# EAGLE design MCU board ATmega328p v2.4 (AW) (EAGLE 9.2.0)
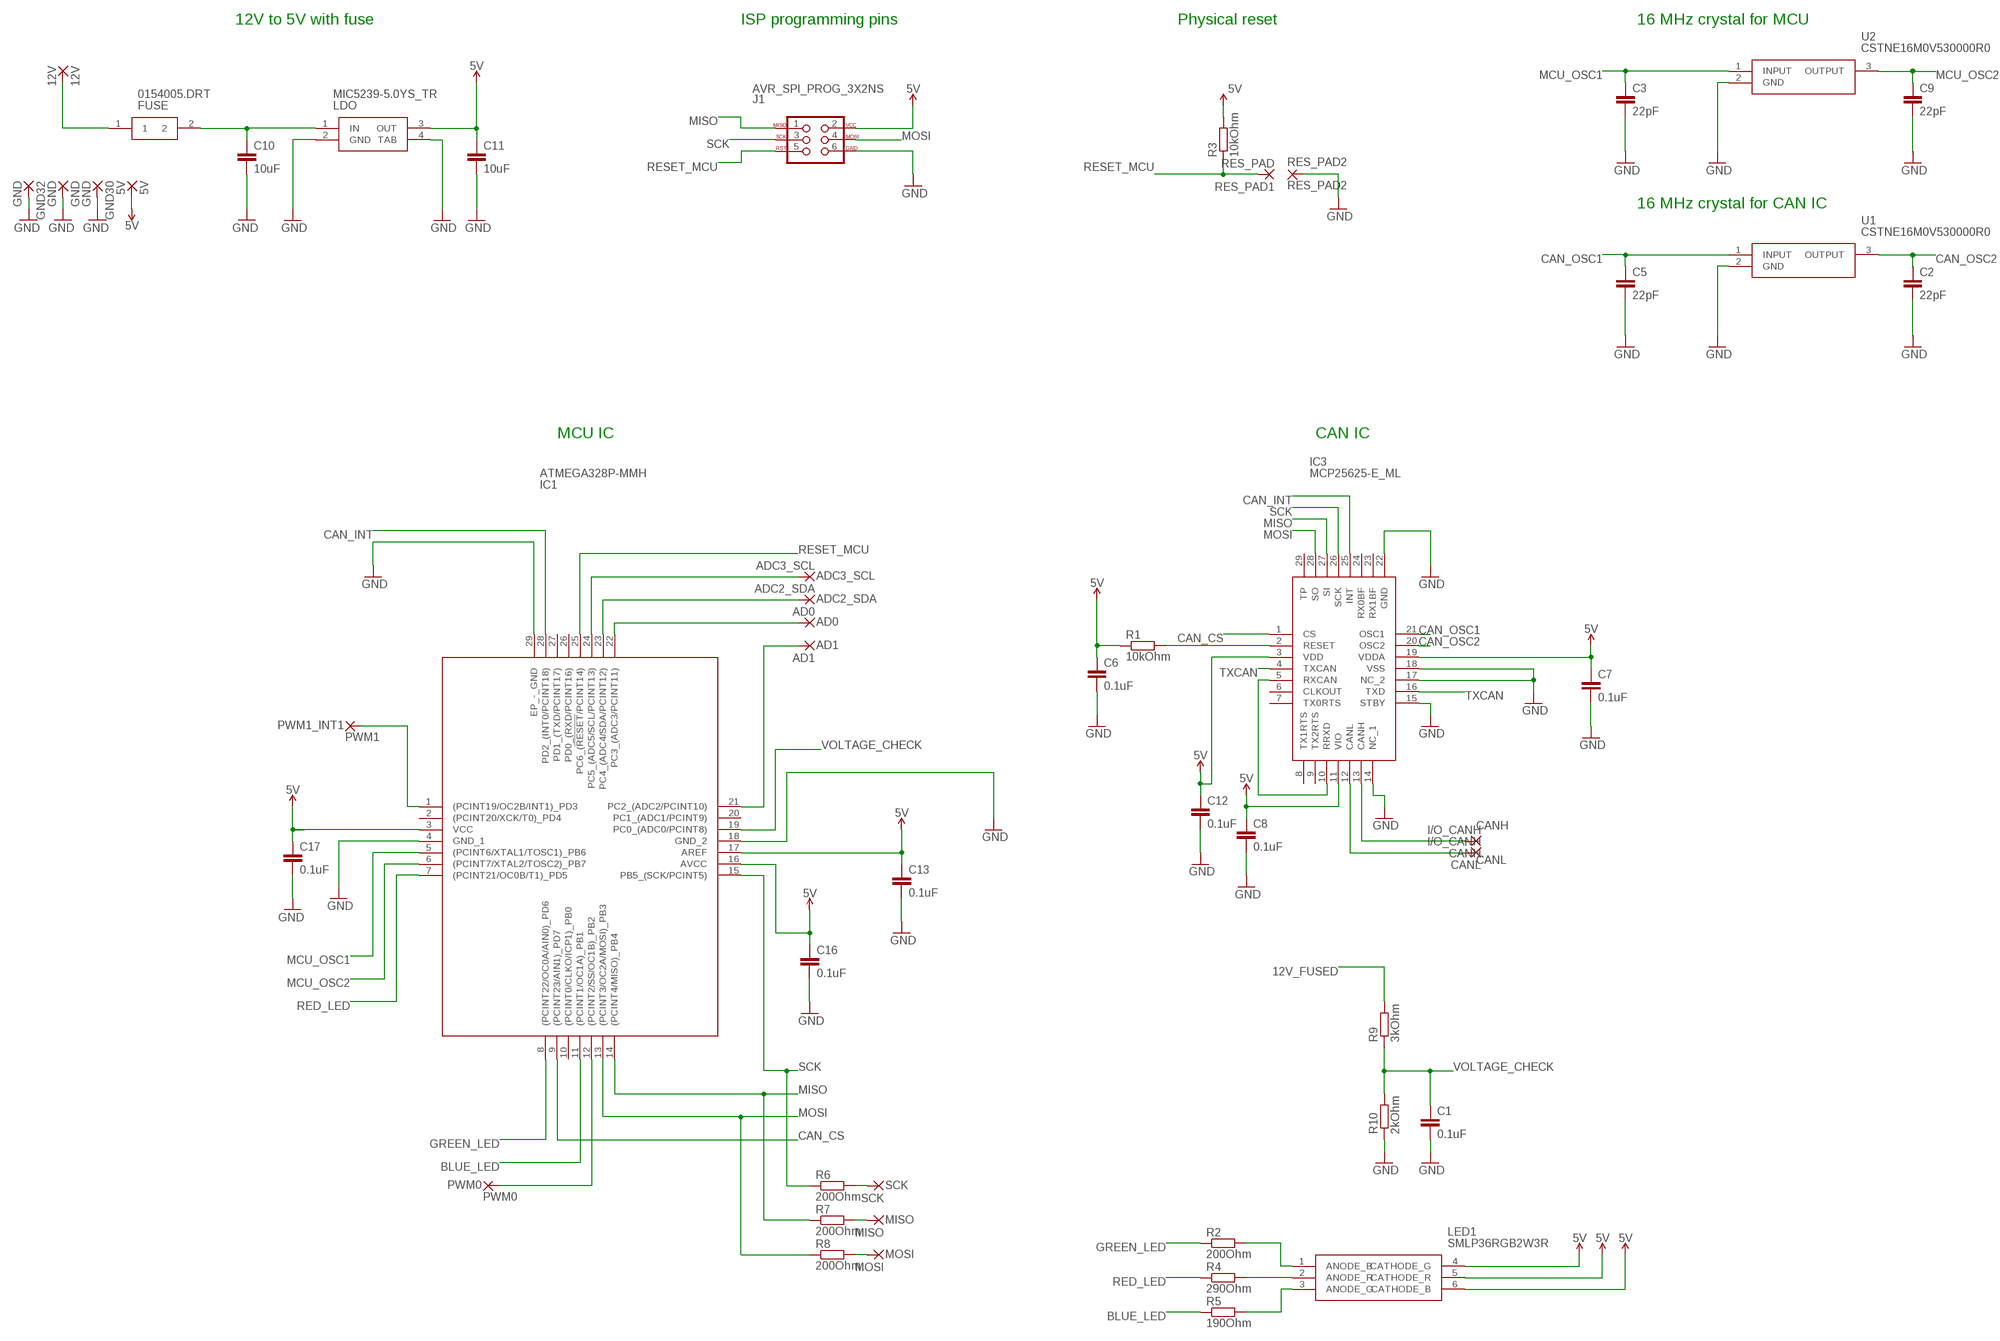
[diagram p0: schematic, sheet 1]

## Parts
5V  5V  2,15/1,0  [2,15/1,0]
12V  12V  2,15/1,0  [2,15/1,0]
AD0  AD0  2,15/1,0  [2,15/1,0]
AD1  AD1  2,15/1,0  [2,15/1,0]
ADC2_SDA  ADC2_SDA  2,15/1,0  [2,15/1,0]
ADC3_SCL  ADC3_SCL  2,15/1,0  [2,15/1,0]
C1  0.1uF  CC0603  [C0603]
C2  22pF  CC0603  [C0603]
C3  22pF  CC0603  [C0603]
C5  22pF  CC0603  [C0603]
C6  0.1uF  CC0603  [C0603]
C7  0.1uF  CC0603  [C0603]
C8  0.1uF  CC0603  [C0603]
C9  22pF  CC0603  [C0603]
C10  10uF  CC0603  [C0603]
C11  10uF  CC0603  [C0603]
C12  0.1uF  CC0603  [C0603]
C13  0.1uF  CC0603  [C0603]
C16  0.1uF  CC0603  [C0603]
C17  0.1uF  CC0603  [C0603]
CANH  I/O_CANH  2,15/1,0  [2,15/1,0]
CANL  I/O_CANH  2,15/1,0  [2,15/1,0]
FUSE  0154005.DRT  [0154001.DRT]
GND  GND  2,15/1,0  [2,15/1,0]
GND30  GND  2,15/1,0  [2,15/1,0]
GND32  GND  2,15/1,0  [2,15/1,0]
IC1  ATMEGA328P-MMH  [QFN45P400X400X100-29N]
IC3  MCP25625-E_ML  [QFN65P600X600X100-29N]
J1  AVR_SPI_PROG_3X2NS  [2X3-NS]
LDO  MIC5239-5.0YS_TR  [SOT230P700X170-4N]
LED1  SMLP36RGB2W3R  [ROHM-1510-(0604)]
MISO  MISO  2,15/1,0  [2,15/1,0]
MOSI  MOSI  2,15/1,0  [2,15/1,0]
PWM0  PWM0  2,15/1,0  [2,15/1,0]
PWM1_INT1  PWM1  2,15/1,0  [2,15/1,0]
R1  10kOhm  RR0603  [R0603]
R2  200Ohm  RR0603  [R0603]
R3  10kOhm  RR0603  [R0603]
R4  290Ohm  RR0603  [R0603]
R5  190Ohm  RR0603  [R0603]
R6  200Ohm  RR0603  [R0603]
R7  200Ohm  RR0603  [R0603]
R8  200Ohm  RR0603  [R0603]
R9  3kOhm  RR0603  [R0603]
R10  2kOhm  RR0603  [R0603]
RES_PAD1  RES_PAD  SMD2  [SMD1,27-2,54]
RES_PAD2  RES_PAD2  SMD2  [SMD1,27-2,54]
SCK  SCK  2,15/1,0  [2,15/1,0]
U1  CSTNE16M0V530000R0  [CSTNE16M0V530000R0]
U2  CSTNE16M0V530000R0  [CSTNE16M0V530000R0]

## Nets
5V: 5V.1(P) C6.1 C7.1 C8.1 C11.1 C12.1 C13.1 C16.1 C17.1 IC1.3(VCC) IC1.16(AVCC) IC1.17(AREF) IC3.3(VDD) IC3.11(VIO) IC3.19(VDDA) J1.2 LDO.3(OUT) LED1.4(CATHODE_G) LED1.5(CATHODE_R) LED1.6(CATHODE_B) R1.1 R3.2
12V_FUSED: C10.1 FUSE.2 LDO.1(IN) R9.2
12V_UNFUSED: 12V.1(P) FUSE.1
BLUE_LED: IC1.11((PCINT1/OC1A)_PB1) R5.1
CAN_CS: IC1.9((PCINT23/AIN1)_PD7) IC3.1(CS)
CAN_INT: IC1.28(PD2_(INT0/PCINT18)) IC3.25(INT)
CAN_OSC1: C5.1 IC3.21(OSC1) U1.1(INPUT)
CAN_OSC2: C2.1 IC3.20(OSC2) U1.3(OUTPUT)
CANH: CANH.1(P) IC3.13(CANH)
CANL: CANL.1(P) IC3.12(CANL)
GND: C1.2 C2.2 C3.2 C5.2 C6.2 C7.2 C8.2 C9.2 C10.2 C11.2 C12.2 C13.2 C16.2 C17.2 GND30.1(P) GND32.1(P) GND.1(P) IC1.4(GND_1) IC1.18(GND_2) IC1.29(EP_-_GND) IC3.14(NC_1) IC3.15(STBY) IC3.17(NC_2) IC3.18(VSS) IC3.22(GND) J1.6 LDO.2(GND) LDO.4(TAB) R10.1 RES_PAD2.1(P) U1.2(GND) U2.2(GND)
GREEN_LED: IC1.8((PCINT22/OC0A/AIN0)_PD6) R2.1
I/O_D2_INT: IC1.1((PCINT19/OC2B/INT1)_PD3) PWM1_INT1.1(P)
MCU_OSC1: C3.1 IC1.5((PCINT6/XTAL1/TOSC1)_PB6) U2.1(INPUT)
MCU_OSC2: C9.1 IC1.6((PCINT7/XTAL2/TOSC2)_PB7) U2.3(OUTPUT)
MISO: IC1.14((PCINT4/MISO)_PB4) IC3.27(SI) J1.1 R7.1
MOSI: IC1.13((PCINT3/OC2A/MOSI)_PB3) IC3.28(SO) J1.4 R8.1
N$1: IC3.2(RESET) R1.2
N$2: IC1.12((PCINT2/SS/OC1B)_PB2) PWM0.1(P)
N$3: AD1.1(P) IC1.21(PC2_(ADC2/PCINT10))
N$4: LED1.1(ANODE_B) R2.2
N$5: AD0.1(P) IC1.22(PC3_(ADC3/PCINT11))
N$6: ADC2_SDA.1(P) IC1.23(PC4_(ADC4/SDA/PCINT12))
N$7: ADC3_SCL.1(P) IC1.24(PC5_(ADC5/SCL/PCINT13))
N$8: LED1.2(ANODE_R) R4.2
N$9: LED1.3(ANODE_G) R5.2
N$10: R6.2 SCK.1(P)
N$11: MISO.1(P) R7.2
N$12: MOSI.1(P) R8.2
RED_LED: IC1.7((PCINT21/OC0B/T1)_PD5) R4.1
RESET_MCU: IC1.25(PC6_(!RESET!/PCINT14)) J1.5 R3.1 RES_PAD1.1(P)
RXCAN: IC3.5(RXCAN) IC3.10(RRXD)
SCK: IC1.15(PB5_(SCK/PCINT5)) IC3.26(SCK) J1.3 R6.1
TXCAN: IC3.4(TXCAN) IC3.16(TXD)
VOLTAGE_CHECK: C1.1 IC1.19(PC0_(ADC0/PCINT8)) R9.1 R10.2
Unconnected: IC1.2((PCINT20/XCK/T0)_PD4) IC1.10((PCINT0/CLKO/ICP1)_PB0) IC1.20(PC1_(ADC1/PCINT9)) IC1.26(PD0_(RXD/PCINT16)) IC1.27(PD1_(TXD/PCINT17)) IC3.6(CLKOUT) IC3.7(TX0RTS) IC3.8(TX1RTS) IC3.9(TX2RTS) IC3.23(RX1BF) IC3.24(RX0BF) IC3.29(TP)

## Notes on the sheet
- 12V to 5V with fuse | ISP programming pins | Physical reset | 16 MHz crystal for MCU
- 16 MHz crystal for CAN IC
- MCU IC | CAN IC

## Library data of the parts
5V 12V AD0 AD1 ADC2_SDA ADC3_SCL CANH CANL GND GND30 GND32 MISO MOSI PWM0 PWM1_INT1 SCK = wirepad:2,15/1,0: THROUGH-HOLE PAD
C1-C3 C5-C13 C16 C17 = eagle-ltspice:C: CAPACITOR, European symbol; SPICEMODEL: NONE; SPICEPREFIX: C
FUSE = 0154005(Fuseholder)DRT:0154005.DRT: Littelfuse 5A T Surface Mount Fuse, 125V ac/dc Source: Datasheet <http://www.littelfuse.com/~/media/electronics/datasheets/fuses/littelfuse_fuse_154_154t_154l_154tl_datasheet.pdf.pdf>; ALLIED_NUMBER: 70184875; ALLIED_PRICE-STOCK: https://www.alliedelec.com/littelfuse-0154005-drt/70184875/; ARROW_PART_NUMBER: 0154005.DRT; ARROW_PRICE-STOCK: https://www.arrow.com/en/products/0154005.drt/littelfuse; DESCRIPTION: Littelfuse 5A T Surface Mount Fuse, 125V ac/dc; HEIGHT: mm; MANUFACTURER_NAME: LITTELFUSE; MANUFACTURER_PART_NUMBER: 0154005.DRT; RS_PART_NUMBER: 2196260P; RS_PRICE-STOCK: http://uk.rs-online.com/web/p/products/2196260P
IC1 = ATMEGA328P-MMH:ATMEGA328P-MMH: Atmel ATMEGA328P-MMH, 8bit AVR Microcontroller, 20MHz, 32 kB Flash, 28-Pin QFN Source: Datasheet <http://uk.rs-online.com/web/p/products/8149138P>; ARROW_PART_NUMBER: ATMEGA328P-MMH; ARROW_PRICE-STOCK: https://www.arrow.com/en/products/atmega328p-mmh/microchip-technology; DESCRIPTION: Atmel ATMEGA328P-MMH, 8bit AVR Microcontroller, 20MHz, 32 kB Flash, 28-Pin QFN; HEIGHT: 1mm; MANUFACTURER_NAME: Microchip; MANUFACTURER_PART_NUMBER: ATMEGA328P-MMH; RS_PART_NUMBER: 1310272P; RS_PRICE-STOCK: http://uk.rs-online.com/web/p/products/1310272P
IC3 = MCP25625-E_ML:MCP25625-E_ML: CAN Controller with Transceiver QFN28 Microchip MCP25625-E/ML, CAN Controller, 28-Pin QFN Source: Datasheet <http://docs-europe.electrocomponents.com/webdocs/137c/0900766b8137cddf.pdf>; ALLIED_NUMBER: 70431541; ALLIED_PRICE-STOCK: http://www.alliedelec.com/microchip-technology-inc-mcp25625-e-ml/70431541/; ARROW_PART_NUMBER: MCP25625-E/ML; ARROW_PRICE-STOCK: https://www.arrow.com/en/products/mcp25625-eml/microchip-technology; DESCRIPTION: CAN Controller with Transceiver QFN28 Microchip MCP25625-E/ML, CAN Controller, 28-Pin QFN; HEIGHT: 1mm; MANUFACTURER_NAME: Microchip; MANUFACTURER_PART_NUMBER: MCP25625-E/ML; RS_PART_NUMBER: 1654104; RS_PRICE-STOCK: http://uk.rs-online.com/web/p/products/1654104
J1 = SparkFun-Connectors:AVR_SPI_PROG_3X2: AVR ISP 6 Pin This is the reduced ISP connector for AVR programming. Common on Arduino. This footprint will take up less PCB space and can be used with a 10-pin to 6-pin adapter such as SKU: BOB-08508 **Special note about "TEST_POINT" package. The stop mask is on the top side, so if you want your programming test points to be on the bottom of your board, make sure to place this package on the bottom side of the board. This also ensure that the orientation to program from the bottom side will be correct. SparkFun Products: SparkFun ISP Pogo Adapter <https://www.sparkfun.com/products/11591> - NS Tiny AVR Programmer <https://www.sparkfun.com/products/11801> -PTH
LDO = MIC5239-5.0YS_TR:MIC5239-5.0YS_TR: LDO Regulator Pos 5V 0.5A Micrel MIC5239-5.0YS TR, LDO Voltage Regulator, 500mA, 5 V 1%, 2.3 30 Vin, 3 + Tab-Pin SOT-223 Source: Datasheet <http://ww1.microchip.com/downloads/en/DeviceDoc/mic5239.pdf>; ARROW_PART_NUMBER: MIC5239-5.0YS TR; ARROW_PRICE-STOCK: http://uk.rs-online.com/web/p/products/7275535P; DESCRIPTION: LDO Regulator Pos 5V 0.5A Micrel MIC5239-5.0YS TR, LDO Voltage Regulator, 500mA, 5 V 1%, 2.3 30 Vin, 3 + Tab-Pin SOT-223; HEIGHT: 1.7mm; MANUFACTURER_NAME: Micrel; MANUFACTURER_PART_NUMBER: MIC5239-5.0YS TR; RS_PART_NUMBER: 7275535P; RS_PRICE-STOCK: http://uk.rs-online.com/web/p/products/7275535P
LED1 = SMLP36RGB2W3R:SMLP36RGB2W3R: LED,RGB,35/110/35mcd,top-looking,1510 ROHM SMLP36RGB2W3R, SML-P36 Series 3 RGB LED, 475 (Blue) nm, 535 (Green) nm, 629 (Red) nm 6-Pin Milky White Source: Datasheet <http://www.rohm.com/web/global/datasheet/SMLP36RGB2W(R)>; ARROW_PART_NUMBER: SMLP36RGB2W3R; ARROW_PRICE-STOCK: https://www.arrow.com/en/products/smlp36rgb2w3r/rohm-semiconductor; DESCRIPTION: LED,RGB,35/110/35mcd,top-looking,1510 ROHM SMLP36RGB2W3R, SML-P36 Series 3 RGB LED, 475 (Blue) nm, 535 (Green) nm, 629 (Red) nm 6-Pin Milky White; HEIGHT: mm; MANUFACTURER_NAME: ROHM Semiconductor; MANUFACTURER_PART_NUMBER: SMLP36RGB2W3R; RS_PART_NUMBER: 1246884P; RS_PRICE-STOCK: http://uk.rs-online.com/web/p/products/1246884P
R1-R10 = eagle-ltspice:R: RESISTOR, European symbol; SPICEMODEL: NONE; SPICEPREFIX: R
RES_PAD1 RES_PAD2 = wirepad:SMD2: SMD PAD
U1 U2 = CSTNE16M0V530000R0:CSTNE16M0V530000R0: Resonators 16.0000MHz 15pF SMD CHP Resntr Source: Datasheet <https://www.murata.com/en-eu/products/productdata/8801162231838/SPEC-CSTNE16M0V530000R0.pdf?1519875007000>; ARROW_PART_NUMBER: CSTNE16M0V530000R0; ARROW_PRICE-STOCK: https://www.arrow.com/en/products/cstne16m0v530000r0/murata-manufacturing; DESCRIPTION: Resonators 16.0000MHz 15pF SMD CHP Resntr; HEIGHT: 1mm; MANUFACTURER_NAME: Murata Electronics; MANUFACTURER_PART_NUMBER: CSTNE16M0V530000R0

## Board
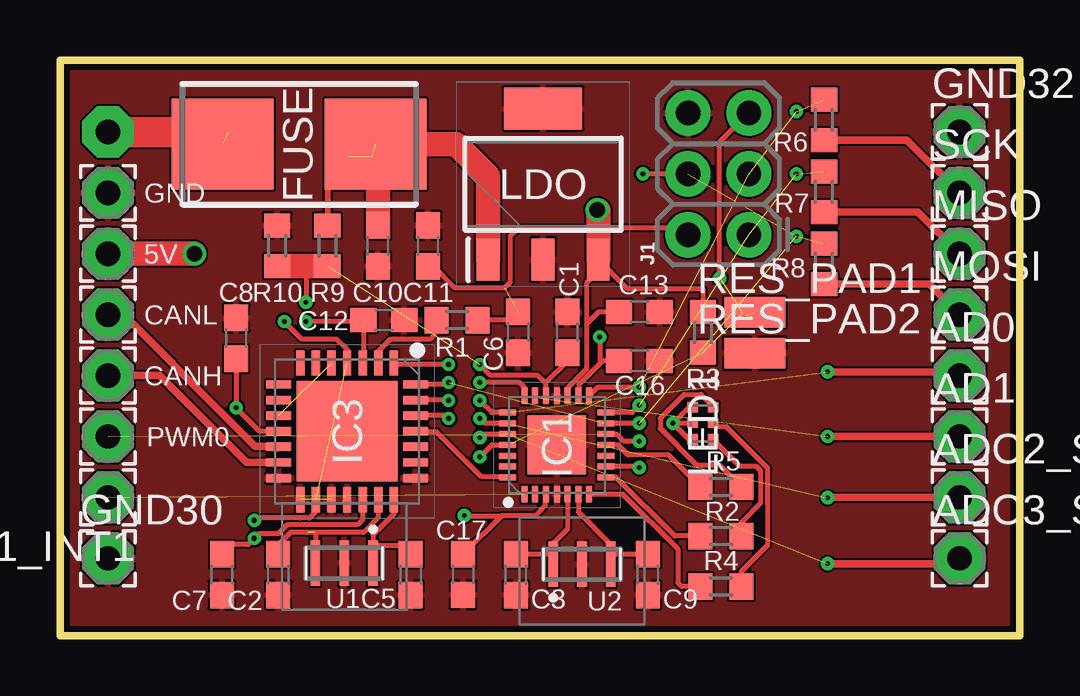
[diagram p1: board, top side]
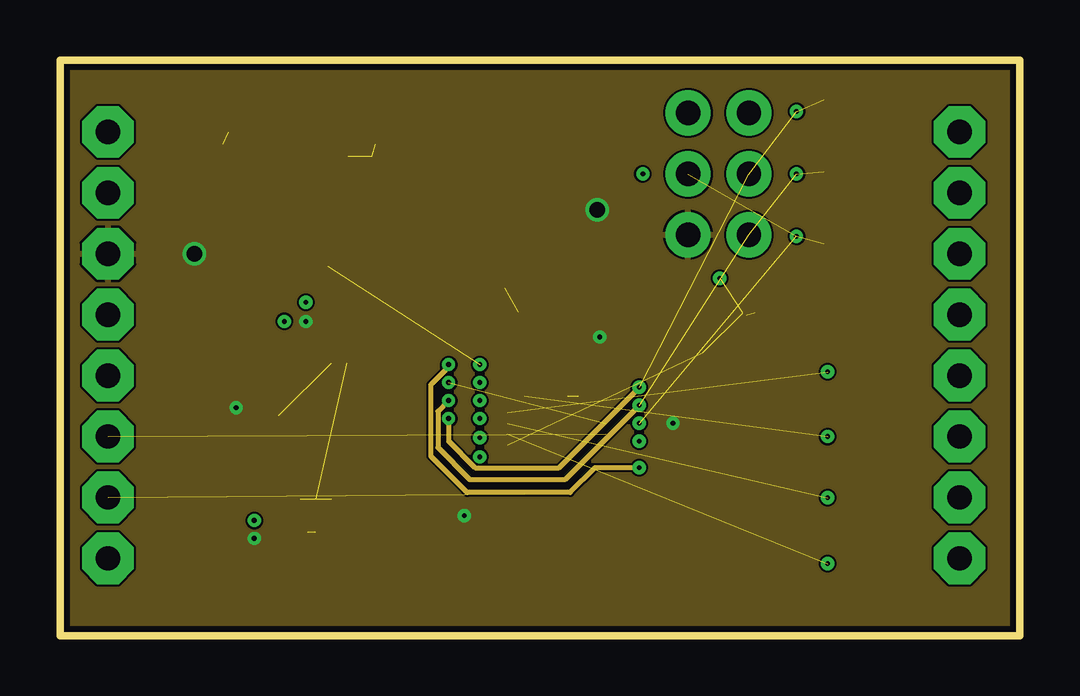
[diagram p2: board, inner layer Route2]
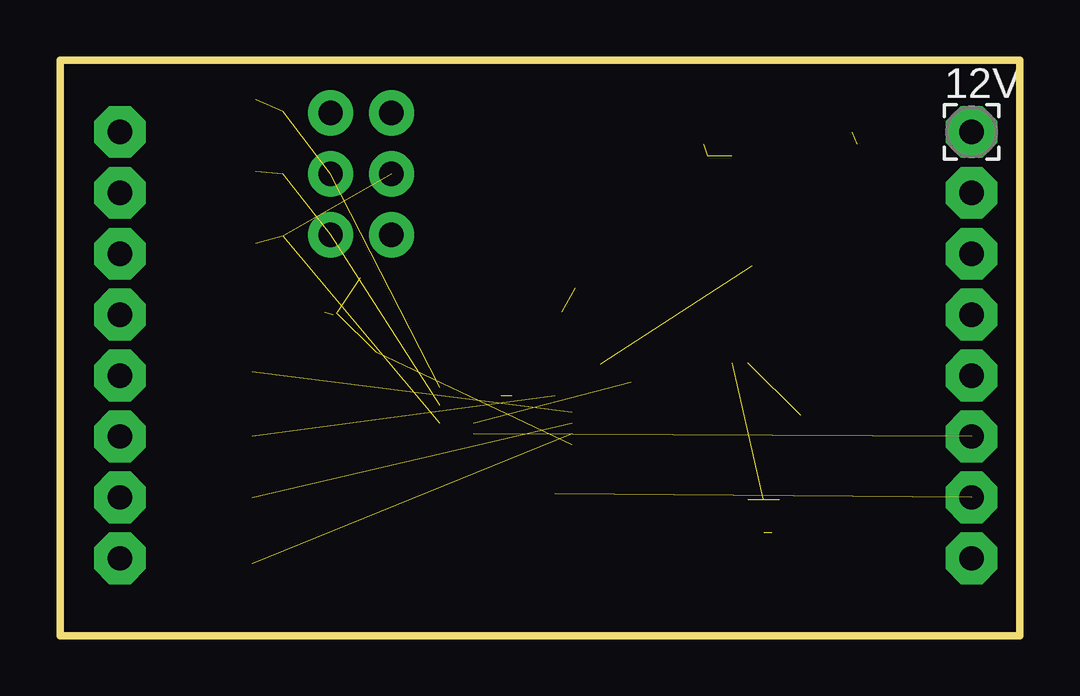
[diagram p3: board, bottom side, seen from below]

Size 40 x 24 mm. Coordinates in mm from the lower left corner, seen from the top.
Outline: 0,0 40,0 40,24 0,24 0,0
Copper layers (1*2*3*4): Top 0.035mm / dielectric 0.432mm / Route2 0.017mm / dielectric 0.432mm / Route3 0.017mm / dielectric 0.432mm / Route4 0.035mm
Design rules "JLC_4L_ACM_CAN *": minimum track width 3.5mil, minimum drill 0.2mm, track to track 3.5mil, track to pad 8mil, pad to pad 6mil, via to via 6mil, smd to smd 6mil, copper to edge 10mil, drill to drill 8mil, minimum pad ring 4mil, minimum via ring 4mil, stop-mask expansion 4mil, vias tented up to drill 25mil, thermal gap 4mil

### Footprints (pad centres in the part's own frame; a part is rotated, then mirrored left to right if it is on the bottom)
2,15/1,0 = drill 1.016 pad 2.159 octagon: 1 0,0
C0603 = smd 1.1 x 1: 1 -0.85,0; 2 0.85,0
0154001.DRT = smd 4.242 x 3.81: 1 -3.188,0; 2 3.188,0
QFN45P400X400X100-29N = smd 0.7 x 0.25: 1 -2.05,1.35; 2 -2.05,0.9; 3 -2.05,0.45; 4 -2.05,0; 5 -2.05,-0.45; 6 -2.05,-0.9; 7 -2.05,-1.35; 15 2.05,-1.35; 16 2.05,-0.9; 17 2.05,-0.45; 18 2.05,0; 19 2.05,0.45; 20 2.05,0.9; 21 2.05,1.35 | smd 0.25 x 0.7: 8 -1.35,-2.05; 9 -0.9,-2.05; 10 -0.45,-2.05; 11 0,-2.05; 12 0.45,-2.05; 13 0.9,-2.05; 14 1.35,-2.05; 22 1.35,2.05; 23 0.9,2.05; 24 0.45,2.05; 25 0,2.05; 26 -0.45,2.05; 27 -0.9,2.05; 28 -1.35,2.05 | smd 2.45 x 2.45: 29 0,0
QFN65P600X600X100-29N = smd 1.05 x 0.35: 1 -2.85,1.95; 2 -2.85,1.3; 3 -2.85,0.65; 4 -2.85,0; 5 -2.85,-0.65; 6 -2.85,-1.3; 7 -2.85,-1.95; 15 2.85,-1.95; 16 2.85,-1.3; 17 2.85,-0.65; 18 2.85,0; 19 2.85,0.65; 20 2.85,1.3; 21 2.85,1.95 | smd 0.35 x 1.05: 8 -1.95,-2.85; 9 -1.3,-2.85; 10 -0.65,-2.85; 11 0,-2.85; 12 0.65,-2.85; 13 1.3,-2.85; 14 1.95,-2.85; 22 1.95,2.85; 23 1.3,2.85; 24 0.65,2.85; 25 0,2.85; 26 -0.65,2.85; 27 -1.3,2.85; 28 -1.95,2.85 | smd 4.2 x 4.2: 29 0,0
2X3-NS = drill 1.016 pad 1.88: 1 -2.54,-1.27; 2 -2.54,1.27; 3 0,-1.27; 4 0,1.27; 5 2.54,-1.27; 6 2.54,1.27
SOT230P700X170-4N = smd 1.75 x 0.95: 1 -3.15,2.3; 2 -3.15,0; 3 -3.15,-2.3 | smd 1.75 x 3.25: 4 3.15,0
ROHM-1510-(0604) = smd 0.45 x 0.45: 1 -0.675,-0.425; 3 0.675,-0.425; 4 0.675,0.425; 6 -0.675,0.425 | smd 0.4 x 0.45: 2 0,-0.425; 5 0,0.425
R0603 = smd 1 x 1.1: 1 -0.85,0; 2 0.85,0
SMD1,27-2,54 = smd 1.27 x 2.54: 1 0,0
CSTNE16M0V530000R0 = smd 0.4 x 1.9: 1 -1.2,0.425; 2 0,0.425; 3 1.2,0.425

### Placement (x,y rotation side)
5V  2,15.92 0 top
12V  2,21 0 bottom
AD0  37.5,10.84 0 top
AD1  37.5,8.3 0 top
ADC2_SDA  37.5,5.76 0 top
ADC3_SCL  37.5,3.22 0 top
C1  21.15,12.65 90 top
C2  9.1,2.54 270 top
C3  19,2.54 270 top
C5  14.61,2.54 270 top
C6  19.1,12.65 270 top
C7  6.75,2.54 270 top
C8  7.35,12.4 90 top
C9  24.5,2.54 270 top
C10  13.25,16.25 270 top
C11  15.35,16.25 90 top
C12  13.5,13.15 0 top
C13  24.15,13.5 0 top
C16  24.15,11.45 0 top
C17  16.8,2.55 270 top
CANH  2,10.84 0 top
CANL  2,13.38 0 top
FUSE  9.97,20.49 0 top
GND  2,18.46 0 top
GND30  2,3.22 0 top
GND32  37.5,21 0 top
IC1  20.71,7.95 90 top
IC3  11.97,8.52 270 top
J1  27.45,19.25 90 top
LDO  20.14,18.82 90 top
LED1  26.8,8.85 90 top
MISO  37.5,15.92 0 top
MOSI  37.5,13.38 0 top
PWM0  2,8.3 0 top
PWM1_INT1  2,5.76 180 top
R1  16.55,13.15 180 top
R2  27.55,4.15 0 top
R3  26.8,12.65 90 top
R4  27.55,2.05 0 top
R5  27.55,6.2 0 top
R6  31.85,21.5 270 top
R7  31.85,18.5 270 top
R8  31.85,15.5 270 top
R9  11.15,16.25 90 top
R10  9.05,16.25 270 top
RES_PAD1  28.96,13.47 270 top
RES_PAD2  28.96,11.78 270 top
SCK  37.5,18.46 0 top
U1  11.85,3.45 180 top
U2  21.76,2.55 0 top

### Tracks (layer width: path | path; a pad name or v marks a point on that pad's centre or on a via)
5V  (via drill 0.2 pad 0.55 layers 1-4, 0.65 pad 0.65 layers 1-4)  (2 unrouted)
  Top 0.2: C11.1 15.56,15.4 16.47,14.49 18.54,14.49 18.77,14.72 18.77,16.64 19.13,17 22.44,17 25.89,17 J1.2 | IC3.11 8.33,8.52 v7.35,9.5 C8.1 | IC3.19 12.62,4.84 12.4,4.62 9.47,4.62 9.1,4.25 8.3,4.25 v8.1,4.05 7.85,3.8 6.97,3.8 C7.1 | R3.2 26.8,14.45 23.66,14.45 LDO.3 | v10.25,13.1 12.6,13.1 C12.1 12.65,11.4 IC3.3 | R1.1 18.75,13.15 C6.1 | IC1.17 21.16,10.33 21.95,11.12 21.95,13 | 22.2,14.95 21.95,14.7 21.95,13 | 21.95,13 22.45,13.5 C13.1 | v22.5,12.45 22.5,11.34 | IC1.16 21.63,10.02 21.63,10.48 22.5,11.34 | 22.5,11.34 22.61,11.45 C16.1 | LED1.5 v25.55,8.85 | LED1.4 26.23,9.53 v25.55,8.85 | LED1.6 26.23,8.18 v25.55,8.85 | C17.1 18.4,5 | IC1.3 20.24,5.88 20.24,5.42 19.81,5 18.4,5 | v16.85,5 18.4,5
  Top 1.016: LDO.3 22.44,17 22.44,17.71 v22.4,17.75 | v5.6,15.92 5V.1
  pour Route2: 0,24 40,24 40,0 0,0
12V_FUSED  (2 unrouted)
  Top 0.254: R9.2 11.15,19.15 12,20
  Top 1.016: LDO.1 17.84,19.16 16.51,20.49 FUSE.2 | C10.1 13.25,19.75 13,20
12V_UNFUSED  (1 unrouted)
  Top 1.27: 7,21 12V.1
BLUE_LED
  Top 0.2: IC1.11 23.25,7.95 23.68,7.53 25.37,7.53 R5.1
CAN_CS  (via drill 0.2 pad 0.55 layers 1-4)
  Top 0.2: 13.92,10.97 IC3.1 13.99,11.3 v16.2,11.3 | v24.15,7 24.1,7.05 IC1.9
  Route2 0.2: v24.15,7 22.31,7 21.27,5.96 16.97,5.96 15.46,7.47 15.46,10.46 16.2,11.2 v16.2,11.3
CAN_INT
  Top 0.2: IC1.28 18.64,6.62 17.58,6.62 15.71,8.5 14.84,8.5 IC3.25
CAN_OSC1
  Top 0.2: IC3.21 13.92,5.07 13.05,4.2 13.05,3.75 | 13.05,3.75 U1.1 | 13.05,3.75 14.25,3.75 C5.1
CAN_OSC2  (1 unrouted)
  Top 0.2: U1.3 10.65,4.3 9.61,4.3 9.1,3.79 C2.1 | IC3.20 13.27,4.92 12.65,4.3 10.32,4.3
CANH
  Top 0.305: 9.09,7.25 IC3.13 7.78,7.22 4.16,10.84 CANH.1
CANL
  Top 0.305: 9.07,7.82 IC3.12 9.1,7.89 8.14,7.89 6.77,9.26 6.77,9.27 2.66,13.38 CANL.1
GND  (1 unrouted)
  pour Top: 0,24 40,24 40,0 0,0
GREEN_LED
  Top 0.2: IC1.8 23.18,6.6 25.63,4.15 R2.1
I/O_D2_INT  (1 unrouted)
MCU_OSC1
  Top 0.2: C3.1 20.56,3.39 U2.1 20.56,3.85 21.16,4.45 IC1.5
MCU_OSC2
  Top 0.2: 21.59,5.88 IC1.6 21.61,5.15 22.91,3.85 22.91,3.39 22.96,3.39 | C9.1 22.96,3.39 | 22.96,3.39 U2.3
MISO  (via drill 0.2 pad 0.55 layers 1-4)  (3 unrouted)
  Top 0.2: IC3.27 16.18,9.82 v16.2,9.8 | IC1.14 23.85,9.3 v24.15,9.6
  Route2 0.2: v24.15,9.6 21.05,6.5 17.09,6.5 15.75,7.84 15.75,9.35 v16.2,9.8
  other vias: 30.7,19.25
MOSI  (via drill 0.2 pad 0.55 layers 1-4)  (4 unrouted)
  Top 0.2: IC3.28 16.12,10.47 v16.2,10.55 | v24.15,8.85 IC1.13 | J1.4 v24.3,19.25
  other vias: 30.7,16.65
N$1
  Top 0.2: IC3.2 13.24,11.4 13.24,11.82 13.77,12.35 15.43,12.35 15.6,12.52 15.6,13.05 R1.2
N$2  (via drill 0.2 pad 0.55 layers 1-4)  (1 unrouted)
  Top 0.2: IC1.12 22.78,8.38 23.24,8.38 23.51,8.1 v24.15,8.1
N$3  (via drill 0.2 pad 0.55 layers 1-4)  (1 unrouted)
  Top 0.2: IC1.21 19.36,10.35 19.16,10.55 v17.5,10.55
  Top 0.305: AD1.1 v32,8.3
N$4
  Top 0.2: 27.22,8.2 LED1.1 28.35,7.05 29.03,7.05 29.2,6.88 29.2,5.52 28.4,4.72 R2.2
N$5  (via drill 0.2 pad 0.55 layers 1-4)  (1 unrouted)
  Top 0.2: IC1.22 18.01,9.3 17.56,9.75 17.55,9.75 v17.5,9.8
  Top 0.305: AD0.1 37.34,11 v32,11
N$6  (via drill 0.2 pad 0.55 layers 1-4)  (1 unrouted)
  Top 0.2: IC1.23 17.7,8.85 v17.5,9.05
  Top 0.305: ADC2_SDA.1 v32.01,5.76 v32,5.75
N$7  (via drill 0.2 pad 0.55 layers 1-4)  (1 unrouted)
  Top 0.2: IC1.24 18.64,8.38 17.68,8.38 17.56,8.25 v17.5,8.25
  Top 0.305: ADC3_SCL.1 37.28,3 v32,3
N$8
  Top 0.2: LED1.2 27.37,8.7 27.78,8.7 29.49,7 29.49,3.76 28.4,2.67 R4.2
N$9
  Top 0.2: R5.2 27.5,7.1 26.56,7.1 25.02,8.63 25.02,9.07 26.01,10.05 26.73,10.05 27.23,9.55 LED1.3
N$10
  Top 0.305: SCK.1 35.31,20.65 R6.2
N$11
  Top 0.305: MISO.1 35.77,17.65 R7.2
N$12
  Top 0.305: MOSI.1 36.23,14.65 R8.2
RED_LED
  Top 0.2: R4.1 25.91,2.05 25.75,2.21 25.75,3.62 23.48,5.89 IC1.7
RESET_MCU  (via drill 0.2 pad 0.55 layers 1-4)  (4 unrouted)
  Top 0.2: 28.47,13.45 28.45,13.47 | v27.5,14.9 27.48,14.92 27.48,20.55 J1.5 | v17.5,7.45 18,7.95 IC1.25
  Top 0.305: 28.62,13.37 28.47,13.45
RXCAN  (1 unrouted)
SCK  (via drill 0.2 pad 0.55 layers 1-4)  (3 unrouted)
  Top 0.2: 14.84,9.15 IC3.26 16.08,9.17 v16.2,9.05 | IC1.15 22.41,10.35 v24.15,10.35
  Route2 0.2: v16.2,9.05 16.2,8.11 17.31,7 20.8,7 v24.15,10.35
  other vias: 30.7,21.85
TXCAN  (via drill 0.2 pad 0.55 layers 1-4)  (1 unrouted)
  Top 0.2: IC3.16 10.67,5.17 10.4,4.9 10,4.9 8.2,4.9 v8.1,4.8 | v9.35,13.1 10.1,12.35 11.54,12.35 11.97,11.92 IC3.4
VOLTAGE_CHECK  (via drill 0.2 pad 0.55 layers 1-4)  (1 unrouted)
  Top 0.2: v10.25,13.9 10.25,15.4 R9.1 | IC1.19 20.24,10.02 20.24,10.53 | 20.24,10.53 19.91,10.85 17.95,10.85 v17.5,11.3 | C1.1 21.15,11.44 20.24,10.53
  Top 1.016: R9.1 R10.2